# EAGLE schematic ultrasonico (EAGLE 6.5.0)
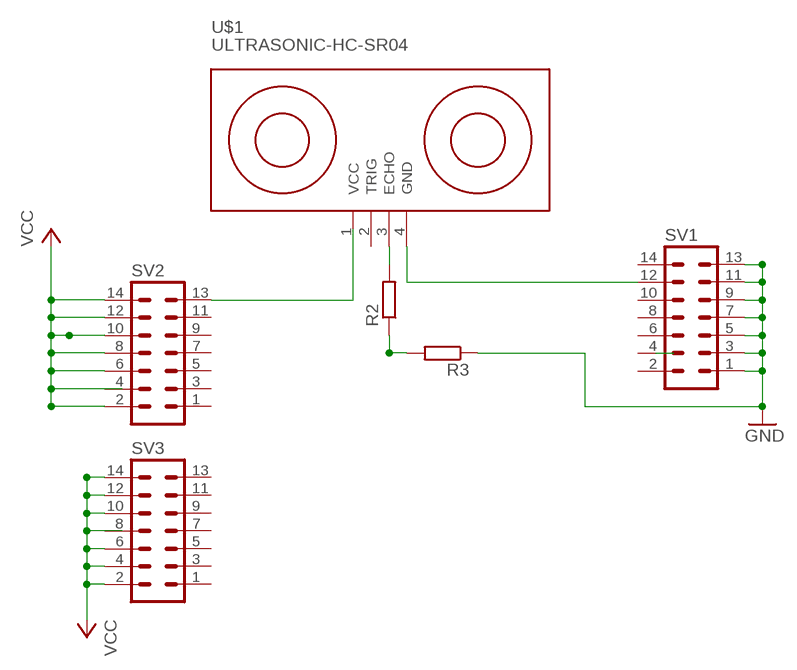
[diagram p0: schematic, sheet 1]

## Parts
R2  R-EU_0309/10  [0309/10]
R3  R-EU_0309/10  [0309/10]
SV1  MA07-2W  [MA07-2W]
SV2  MA07-2W  [MA07-2W]
SV3  MA07-2W  [MA07-2W]
U$1  ULTRASONIC-HC-SR04  [ULTRASONIC-HC-SR04]

## Nets
GND: R3.1 SV1.1 SV1.3 SV1.5 SV1.7 SV1.9 SV1.11 SV1.13
N$1: SV2.13
N$2: R2.2 U$1.3(ECHO)
N$4: R2.1 R3.2
N$5: SV1.12 U$1.4(GND)
VCC: SV2.2 SV2.6 SV2.8 SV2.10 SV2.12 SV2.14 SV3.2 SV3.4 SV3.6 SV3.10 SV3.12 SV3.14
Unconnected: SV1.2 SV1.4 SV1.6 SV1.8 SV1.10 SV1.14 SV2.1 SV2.3 SV2.4 SV2.5 SV2.7 SV2.9 SV2.11 SV3.1 SV3.3 SV3.5 SV3.7 SV3.8 SV3.9 SV3.11 SV3.13 U$1.2(TRIG)

## Power pins joined to a net without a drawn wire
VCC: U$1.1(VCC)

## Library data of the parts
R2 R3 = resistor:R-EU_: RESISTOR, European symbol
SV1-SV3 = con-lstb:MA07-2W: PIN HEADER; OC_FARNELL: unknown; OC_NEWARK: unknown
U$1 = diy-modules:ULTRASONIC-HC-SR04: Ultrasonic Ranging Module HC-SR04 More details available here: http://randomnerdtutorials.com/complete-guide-for-ultrasonic-sensor-hc-sr04/ Click here to find device on ebay.com <http://www.ebay.com/sch/hc+sr04+ultrasonic>